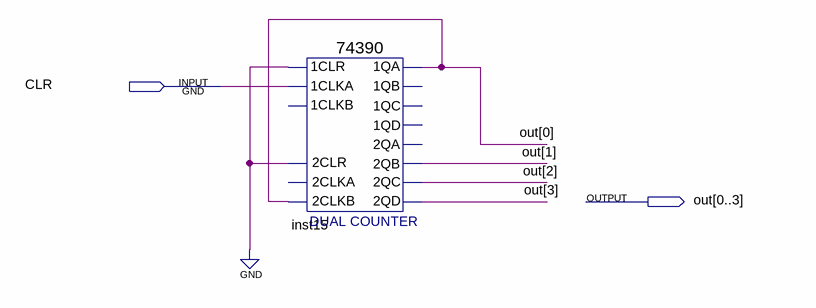
[diagram p0: schematic sheet]
// Quartus schematic 10SyncCounter.bdf as structural Verilog: 1 symbols, 2 pins
module \10SyncCounter  (
  input  CLR,
  output [0:3] out
);

  \74390  inst15 (
    .\2CLR (1'b0), .\2CLKB (out[0]), .\1CLR (1'b0), .\1CLKA (CLR), .\1QA (out[0]), .\2QB (out[1]),
    .\2QC (out[2]), .\2QD (out[3]));  // open: 2CLKA, 1CLKB, 1QB, 1QC, 1QD, 2QA
endmodule
